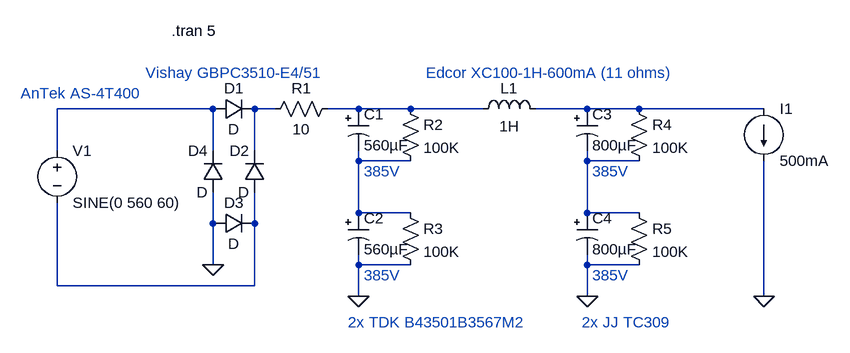
[diagram p0: schematic B+Supply.asc]
B+Supply.asc, the LTspice schematic file:
Version 4
SHEET 1 1996 1392
WIRE -144 64 -384 64
WIRE -48 64 -80 64
WIRE 80 64 32 64
WIRE 160 64 80 64
WIRE 272 64 160 64
WIRE 432 64 352 64
WIRE 512 64 432 64
WIRE 704 64 512 64
WIRE -384 128 -384 64
WIRE -144 128 -144 64
WIRE -80 128 -80 64
WIRE 80 144 80 128
WIRE 160 144 80 144
WIRE 432 144 432 128
WIRE 512 144 432 144
WIRE 80 224 80 144
WIRE 160 224 80 224
WIRE 432 224 432 144
WIRE 512 224 432 224
WIRE -144 240 -144 192
WIRE -80 240 -80 192
WIRE -144 304 -144 240
WIRE 80 304 80 288
WIRE 160 304 80 304
WIRE 432 304 432 288
WIRE 512 304 432 304
WIRE -384 336 -384 208
WIRE -80 336 -80 240
WIRE -80 336 -384 336
WIRE 80 352 80 304
WIRE 432 352 432 304
WIRE 704 352 704 144
FLAG -144 304 0
FLAG 80 352 0
FLAG 432 352 0
FLAG 704 352 0
SYMBOL voltage -384 112 R0
SYMATTR InstName V1
SYMATTR Value SINE(0 560 60)
SYMBOL diode -144 80 R270
WINDOW 0 32 32 VTop 2
WINDOW 3 0 32 VBottom 2
SYMATTR InstName D1
SYMBOL diode -64 192 R180
WINDOW 0 24 64 Left 2
WINDOW 3 24 0 Left 2
SYMATTR InstName D2
SYMBOL diode -144 256 R270
WINDOW 0 32 32 VTop 2
WINDOW 3 0 32 VBottom 2
SYMATTR InstName D3
SYMBOL diode -128 192 R180
WINDOW 0 24 64 Left 2
WINDOW 3 24 0 Left 2
SYMATTR InstName D4
SYMBOL res 48 48 R90
WINDOW 0 0 56 VBottom 2
WINDOW 3 32 56 VTop 2
SYMATTR InstName R1
SYMATTR Value 10
SYMBOL polcap 64 64 R0
SYMATTR InstName C1
SYMATTR Value 560µF
SYMBOL polcap 64 224 R0
SYMATTR InstName C2
SYMATTR Value 560µF
SYMBOL res 144 48 R0
SYMATTR InstName R2
SYMATTR Value 100K
SYMBOL res 144 208 R0
SYMATTR InstName R3
SYMATTR Value 100K
SYMBOL polcap 416 64 R0
SYMATTR InstName C3
SYMATTR Value 800µF
SYMBOL polcap 416 224 R0
SYMATTR InstName C4
SYMATTR Value 800µF
SYMBOL res 496 48 R0
SYMATTR InstName R4
SYMATTR Value 100K
SYMBOL res 496 208 R0
SYMATTR InstName R5
SYMATTR Value 100K
SYMBOL ind 256 80 R270
WINDOW 0 32 56 VTop 2
WINDOW 3 5 56 VBottom 2
SYMATTR InstName L1
SYMATTR Value 1H
SYMATTR SpiceLine Rser=11
SYMBOL current 704 64 R0
SYMATTR InstName I1
SYMATTR Value 500mA
TEXT -208 -56 Left 2 !.tran 5
TEXT -440 40 Left 2 ;AnTek AS-4T400
TEXT -248 8 Left 2 ;Vishay GBPC3510-E4/51
TEXT 184 8 Left 2 ;Edcor XC100-1H-600mA (11 ohms)
TEXT 88 160 Left 2 ;385V
TEXT 88 320 Left 2 ;385V
TEXT 440 160 Left 2 ;385V
TEXT 440 320 Left 2 ;385V
TEXT 64 392 Left 2 ;2x TDK B43501B3567M2
TEXT 424 392 Left 2 ;2x JJ TC309

The netlist it stands for:
* B+Supply.asc
V1 N001 N007 SINE(0 560 60)
D1 N001 N002 D
D2 N007 N002 D
D3 0 N007 D
D4 0 N001 D
R1 N003 N002 10
C1 N003 N005 560µF
C2 N005 0 560µF
R2 N003 N005 100K
R3 N005 0 100K
C3 N004 N006 800µF
C4 N006 0 800µF
R4 N004 N006 100K
R5 N006 0 100K
L1 N003 N004 1H Rser=11
I1 N004 0 500mA
.model D D
.lib standard.dio
.tran 5
* AnTek AS-4T400
* Vishay GBPC3510-E4/51
* Edcor XC100-1H-600mA (11 ohms)
* 385V
* 385V
* 385V
* 385V
* 2x TDK B43501B3567M2
* 2x JJ TC309
.backanno
.end